# Altium schematic sheet BLE.SchDoc
size A4; SheetNumber: 3; SheetTotal: 7
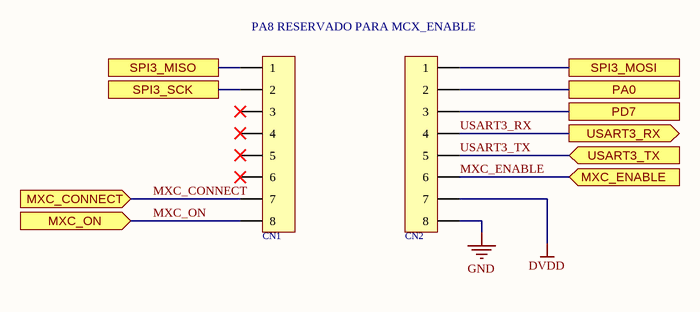
[diagram p0: BLE.SchDoc]

## Parts
CN1  DW200R-11-08-43  [DW200R-11-08-43]  (value not drawn)
CN2  DW200R-11-08-43  [DW200R-11-08-43]  (value not drawn)

## Ports
MXC_CONNECT (in), MXC_ENABLE (in), MXC_ON (in), PA0, PD7, SPI3_MISO, SPI3_MOSI, SPI3_SCK, USART3_RX (out), USART3_TX (in)

## Nets
DVDD: CN2.7
GND: CN2.8
MXC_CONNECT: CN1.7 ; port MXC_CONNECT
MXC_ENABLE: CN2.6 ; port MXC_ENABLE
MXC_ON: CN1.8 ; port MXC_ON
PA0: CN2.2 ; port PA0
PD7: CN2.3 ; port PD7
SPI3_MISO: CN1.1 ; port SPI3_MISO
SPI3_MOSI: CN2.1 ; port SPI3_MOSI
SPI3_SCK: CN1.2 ; port SPI3_SCK
USART3_RX: CN2.4 ; port USART3_RX
USART3_TX: CN2.5 ; port USART3_TX

Not connected (* = marked no-connect by the designer): CN1 3* 4* 5* 6*

## Notes on the sheet
- PA8 RESERVADO PARA MCX_ENABLE
- Title:
- Size: A4
- Date:
- FMC-320U MODEL A
- Sheet:
- Time:
- Of:
- Version:
- Revision:
- Release:
- 1
- 0
- FLOWMEET SRL
- File

## Library data of the parts
CN1 CN2 = DW200R-11-08-43: 1 x 8 - tru hole 2mm - altura 4.3mm; Manufacturer: Dealon; System: Connector; Manufacturer Part Number: DW200R-11-08-43; Category: Header hembra; Datasheet: https://datasheet.lcsc.com/lcsc/2201121730_DEALON-DW200R-11-08-43_C2935972.pdf; Temperature Max: -; Temperature Min: -; Supplier: LCSC